# Altium schematic sheet [08] - CPU - SPI, I2C, SD, MMC.SchDoc
size A2; DocumentNumber: 8; SheetNumber: 8; SheetTotal: 20
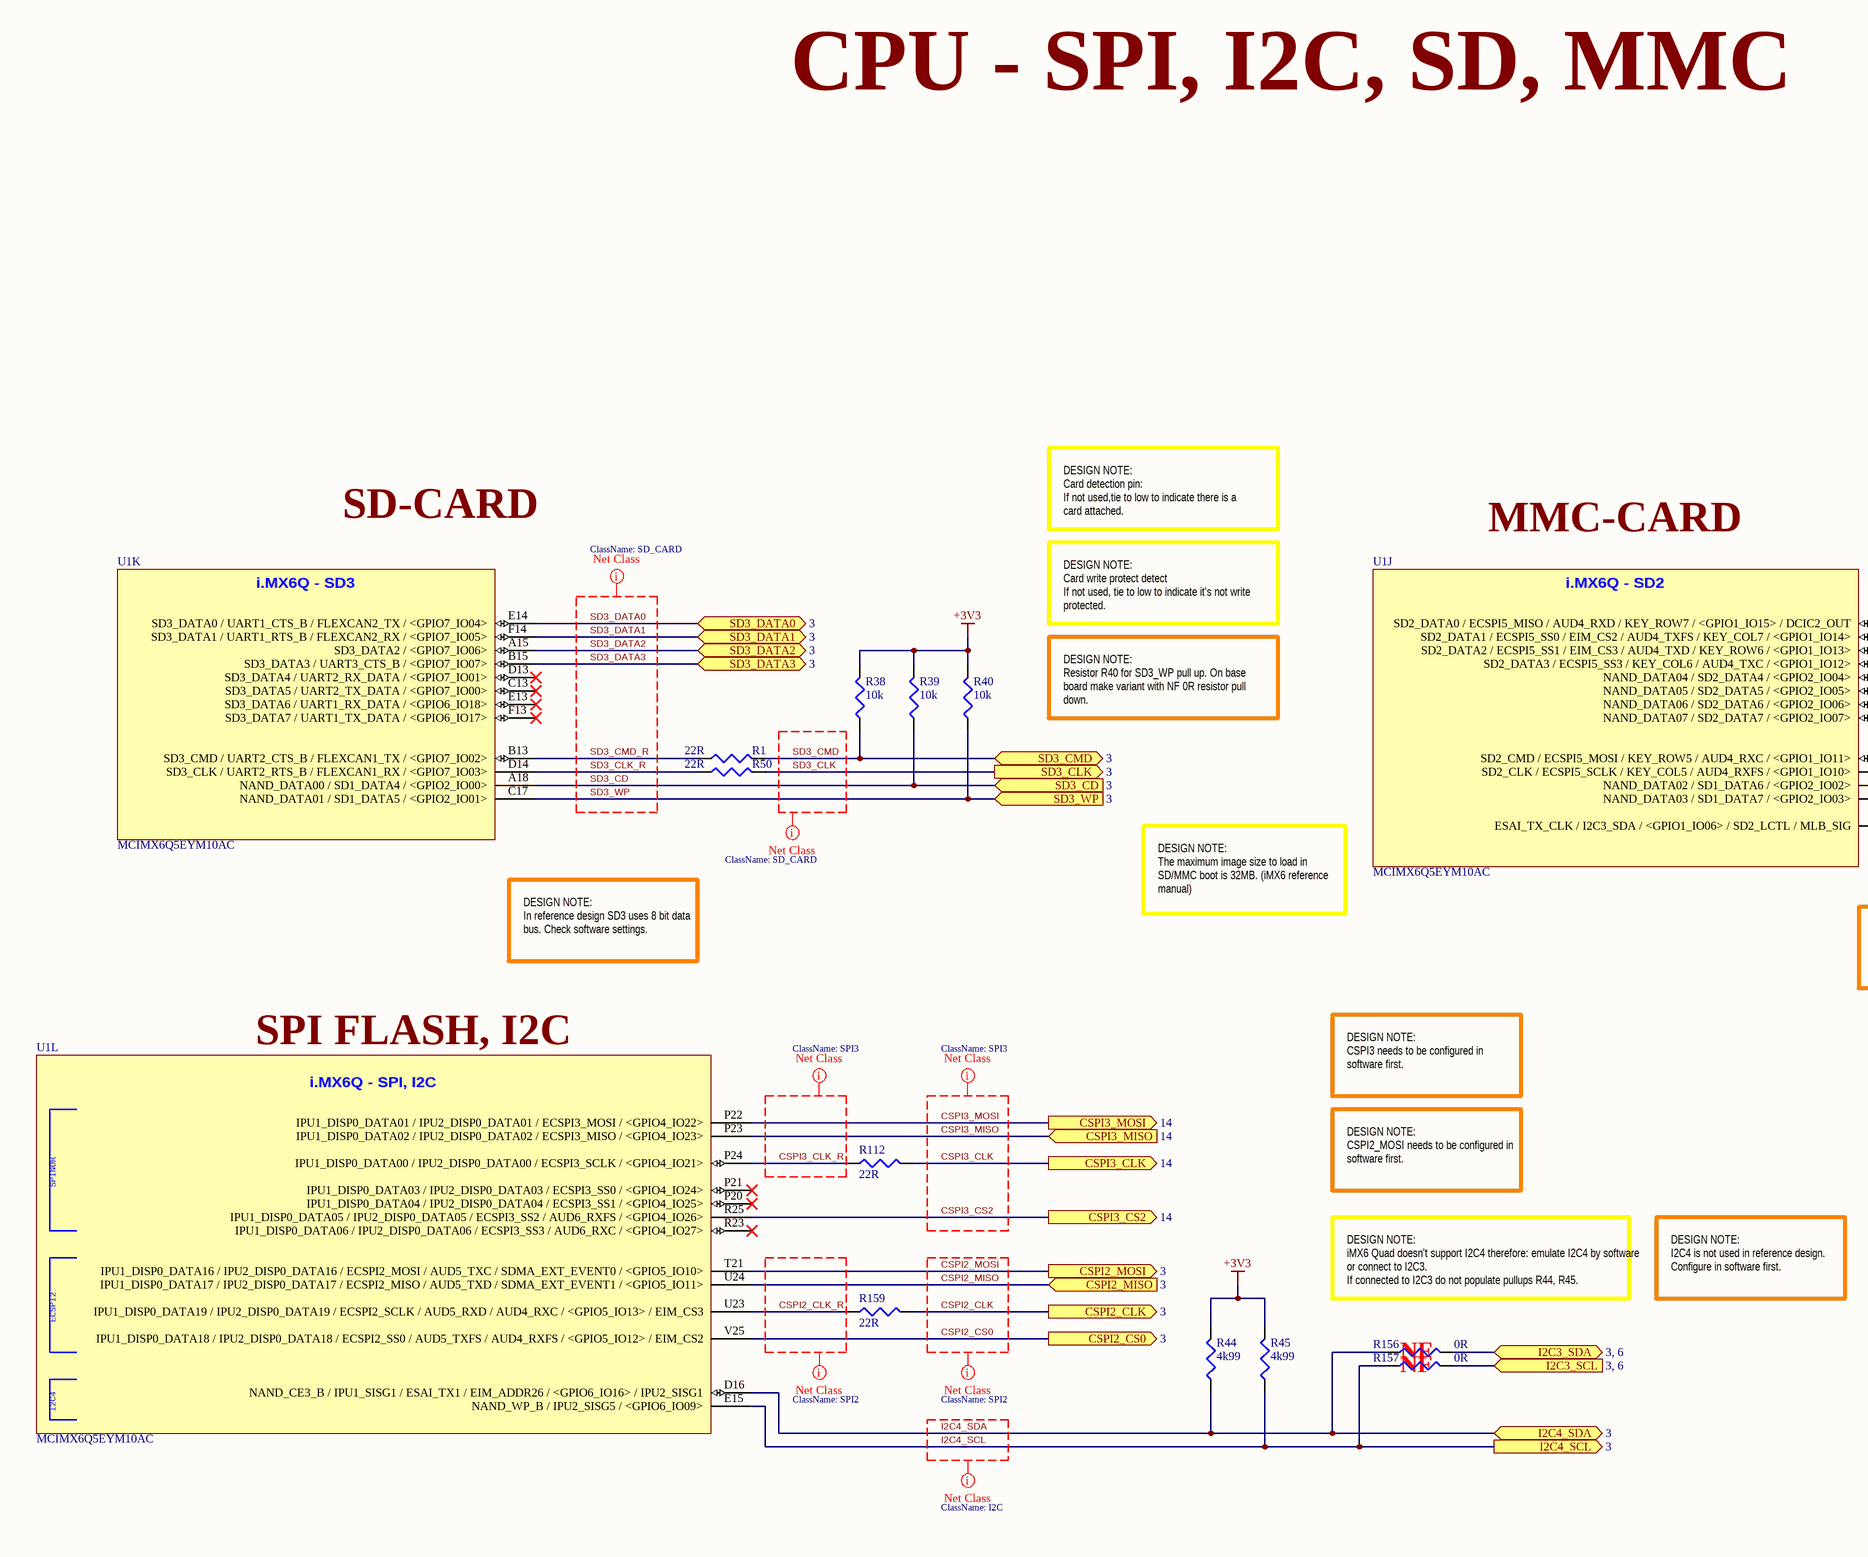
[diagram p0: [08] - CPU - SPI, I2C, SD, MMC.SchDoc, left]
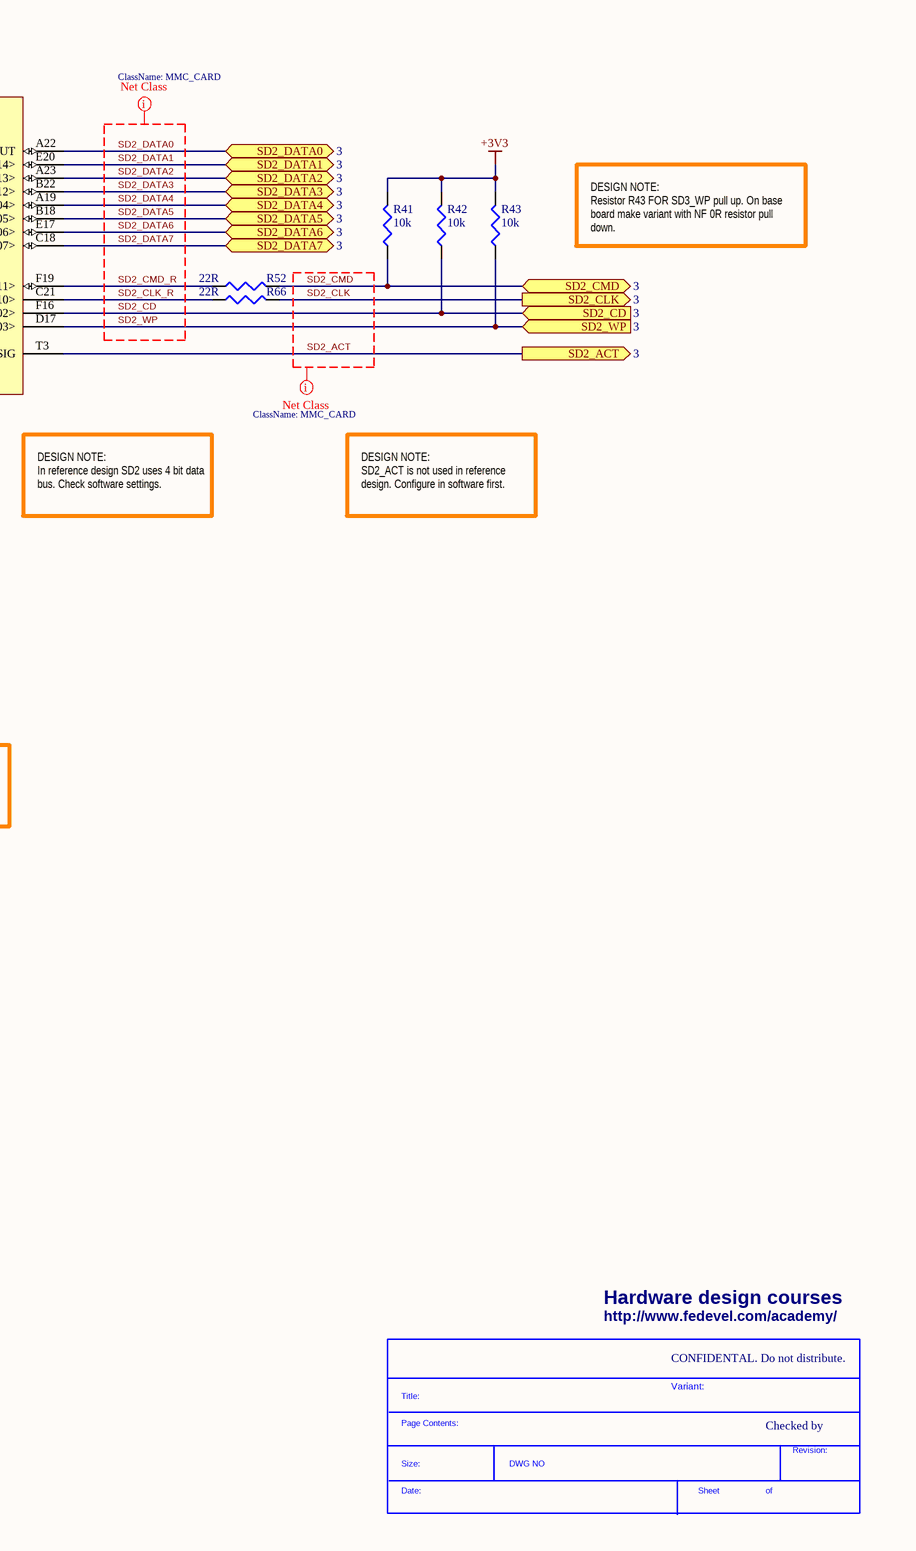
[diagram p1: [08] - CPU - SPI, I2C, SD, MMC.SchDoc, right]

## Parts
*  SDTitleBlock  (value not drawn)  (graphical)
R1  22R  [R0402]
R38  10k  [R0402]
R39  10k  [R0402]
R40  10k  [R0402]
R41  10k  [R0402]
R42  10k  [R0402]
R43  10k  [R0402]
R44  4k99  [R0402]
R45  4k99  [R0402]
R50  22R  [R0402]
R52  22R  [R0402]
R66  22R  [R0402]
R112  22R  [R0402]
R156  0R  [R0402]
R157  0R  [R0402]
R159  22R  [R0402]
U1  MCIMX6Q5EYM10AC  [PBGA624]  (parts J,K,L of 15)

## Ports
CSPI2_CLK (out, see 3), CSPI2_CS0 (out, see 3), CSPI2_MISO (in, see 3), CSPI2_MOSI (out, see 3), CSPI3_CLK (out, see 14), CSPI3_CS2 (out, see 14), CSPI3_MISO (in, see 14), CSPI3_MOSI (out, see 14), I2C3_SCL (see 3, 6), I2C3_SDA (bidir, see 3, 6), I2C4_SCL (out, see 3), I2C4_SDA (bidir, see 3), SD2_ACT (out, see 3), SD2_CD (in, see 3), SD2_CLK (out, see 3), SD2_CMD (bidir, see 3), SD2_DATA0 (bidir, see 3), SD2_DATA1 (bidir, see 3), SD2_DATA2 (bidir, see 3), SD2_DATA3 (bidir, see 3), SD2_DATA4 (bidir, see 3), SD2_DATA5 (bidir, see 3), SD2_DATA6 (bidir, see 3), SD2_DATA7 (bidir, see 3), SD2_WP (in, see 3), SD3_CD (in, see 3), SD3_CLK (out, see 3), SD3_CMD (bidir, see 3), SD3_DATA0 (bidir, see 3), SD3_DATA1 (bidir, see 3), SD3_DATA2 (bidir, see 3), SD3_DATA3 (bidir, see 3), SD3_WP (in, see 3)

## Nets
+3V3: R38.2 R39.2 R40.2 R41.2 R42.2 R43.2 R44.2 R45.2
CSPI2_CLK: R159.2 ; port CSPI2_CLK
CSPI2_CLK_R: R159.1 U1.U23(IPU1_DISP0_DATA19_/_IPU2_DISP0_DATA19_/_ECSPI2_SCLK_/_AUD5_RXD_/_AUD4_RXC_/_<GPIO5_IO13>_/_EIM_CS3)
CSPI2_CS0: U1.V25(IPU1_DISP0_DATA18_/_IPU2_DISP0_DATA18_/_ECSPI2_SS0_/_AUD5_TXFS_/_AUD4_RXFS_/_<GPIO5_IO12>_/_EIM_CS2) ; port CSPI2_CS0
CSPI2_MISO: U1.U24(IPU1_DISP0_DATA17_/_IPU2_DISP0_DATA17_/_ECSPI2_MISO_/_AUD5_TXD_/_SDMA_EXT_EVENT1_/_<GPIO5_IO11>) ; port CSPI2_MISO
CSPI2_MOSI: U1.T21(IPU1_DISP0_DATA16_/_IPU2_DISP0_DATA16_/_ECSPI2_MOSI_/_AUD5_TXC_/_SDMA_EXT_EVENT0_/_<GPIO5_IO10>) ; port CSPI2_MOSI
CSPI3_CLK: R112.2 ; port CSPI3_CLK
CSPI3_CLK_R: R112.1 U1.P24(IPU1_DISP0_DATA00_/_IPU2_DISP0_DATA00_/_ECSPI3_SCLK_/_<GPIO4_IO21>)
CSPI3_CS2: U1.R25(IPU1_DISP0_DATA05_/_IPU2_DISP0_DATA05_/_ECSPI3_SS2_/_AUD6_RXFS_/_<GPIO4_IO26>) ; port CSPI3_CS2
CSPI3_MISO: U1.P23(IPU1_DISP0_DATA02_/_IPU2_DISP0_DATA02_/_ECSPI3_MISO_/_<GPIO4_IO23>) ; port CSPI3_MISO
CSPI3_MOSI: U1.P22(IPU1_DISP0_DATA01_/_IPU2_DISP0_DATA01_/_ECSPI3_MOSI_/_<GPIO4_IO22>) ; port CSPI3_MOSI
I2C3_SCL: R157.2 ; port I2C3_SCL
I2C3_SDA: R156.2 ; port I2C3_SDA
I2C4_SCL: R45.1 R157.1 U1.E15(NAND_WP_B_/_IPU2_SISG5_/_<GPIO6_IO09>) ; port I2C4_SCL
I2C4_SDA: R44.1 R156.1 U1.D16(NAND_CE3_B_/_IPU1_SISG1_/_ESAI_TX1_/_EIM_ADDR26_/_<GPIO6_IO16>_/_IPU2_SISG1) ; port I2C4_SDA
SD2_ACT: U1.T3(ESAI_TX_CLK_/_I2C3_SDA_/_<GPIO1_IO06>_/_SD2_LCTL_/_MLB_SIG) ; port SD2_ACT
SD2_CD: R42.1 U1.F16(NAND_DATA02_/_SD1_DATA6_/_<GPIO2_IO02>) ; port SD2_CD
SD2_CLK: R66.2 ; port SD2_CLK
SD2_CLK_R: R66.1 U1.C21(SD2_CLK_/_ECSPI5_SCLK_/_KEY_COL5_/_AUD4_RXFS_/_<GPIO1_IO10>)
SD2_CMD: R41.1 R52.2 ; port SD2_CMD
SD2_CMD_R: R52.1 U1.F19(SD2_CMD_/_ECSPI5_MOSI_/_KEY_ROW5_/_AUD4_RXC_/_<GPIO1_IO11>)
SD2_DATA0: U1.A22(SD2_DATA0_/_ECSPI5_MISO_/_AUD4_RXD_/_KEY_ROW7_/_<GPIO1_IO15>_/_DCIC2_OUT) ; port SD2_DATA0
SD2_DATA1: U1.E20(SD2_DATA1_/_ECSPI5_SS0_/_EIM_CS2_/_AUD4_TXFS_/_KEY_COL7_/_<GPIO1_IO14>) ; port SD2_DATA1
SD2_DATA2: U1.A23(SD2_DATA2_/_ECSPI5_SS1_/_EIM_CS3_/_AUD4_TXD_/_KEY_ROW6_/_<GPIO1_IO13>) ; port SD2_DATA2
SD2_DATA3: U1.B22(SD2_DATA3_/_ECSPI5_SS3_/_KEY_COL6_/_AUD4_TXC_/_<GPIO1_IO12>) ; port SD2_DATA3
SD2_DATA4: U1.A19(NAND_DATA04_/_SD2_DATA4_/_<GPIO2_IO04>) ; port SD2_DATA4
SD2_DATA5: U1.B18(NAND_DATA05_/_SD2_DATA5_/_<GPIO2_IO05>) ; port SD2_DATA5
SD2_DATA6: U1.E17(NAND_DATA06_/_SD2_DATA6_/_<GPIO2_IO06>) ; port SD2_DATA6
SD2_DATA7: U1.C18(NAND_DATA07_/_SD2_DATA7_/_<GPIO2_IO07>) ; port SD2_DATA7
SD2_WP: R43.1 U1.D17(NAND_DATA03_/_SD1_DATA7_/_<GPIO2_IO03>) ; port SD2_WP
SD3_CD: R39.1 U1.A18(NAND_DATA00_/_SD1_DATA4_/_<GPIO2_IO00>) ; port SD3_CD
SD3_CLK: R50.2 ; port SD3_CLK
SD3_CLK_R: R50.1 U1.D14(SD3_CLK_/_UART2_RTS_B_/_FLEXCAN1_RX_/_<GPIO7_IO03>)
SD3_CMD: R1.2 R38.1 ; port SD3_CMD
SD3_CMD_R: R1.1 U1.B13(SD3_CMD_/_UART2_CTS_B_/_FLEXCAN1_TX_/_<GPIO7_IO02>)
SD3_DATA0: U1.E14(SD3_DATA0_/_UART1_CTS_B_/_FLEXCAN2_TX_/_<GPIO7_IO04>) ; port SD3_DATA0
SD3_DATA1: U1.F14(SD3_DATA1_/_UART1_RTS_B_/_FLEXCAN2_RX_/_<GPIO7_IO05>) ; port SD3_DATA1
SD3_DATA2: U1.A15(SD3_DATA2_/_<GPIO7_IO06>) ; port SD3_DATA2
SD3_DATA3: U1.B15(SD3_DATA3_/_UART3_CTS_B_/_<GPIO7_IO07>) ; port SD3_DATA3
SD3_WP: R40.1 U1.C17(NAND_DATA01_/_SD1_DATA5_/_<GPIO2_IO01>) ; port SD3_WP

Not connected (* = marked no-connect by the designer): U1 C13(SD3_DATA5_/_UART2_TX_DATA_/_<GPIO7_IO00>)* D13(SD3_DATA4_/_UART2_RX_DATA_/_<GPIO7_IO01>)* E13(SD3_DATA6_/_UART1_RX_DATA_/_<GPIO6_IO18>)* F13(SD3_DATA7_/_UART1_TX_DATA_/_<GPIO6_IO17>)* P20(IPU1_DISP0_DATA04_/_IPU2_DISP0_DATA04_/_ECSPI3_SS1_/_<GPIO4_IO25>)* P21(IPU1_DISP0_DATA03_/_IPU2_DISP0_DATA03_/_ECSPI3_SS0_/_<GPIO4_IO24>)* R23(IPU1_DISP0_DATA06_/_IPU2_DISP0_DATA06_/_ECSPI3_SS3_/_AUD6_RXC_/_<GPIO4_IO27>)*

## Layout directives
net class SPI3: CSPI3_CLK, CSPI3_CLK_R, CSPI3_CS2, CSPI3_MISO, CSPI3_MOSI
net class SPI2: CSPI2_CLK, CSPI2_CLK_R, CSPI2_CS0, CSPI2_MISO, CSPI2_MOSI
net class I2C: I2C4_SCL, I2C4_SDA
net class SD_CARD: SD3_CD, SD3_CLK, SD3_CLK_R, SD3_CMD, SD3_CMD_R, SD3_DATA0, SD3_DATA1, SD3_DATA2, SD3_DATA3, SD3_WP
net class MMC_CARD: SD2_ACT, SD2_CD, SD2_CLK, SD2_CLK_R, SD2_CMD, SD2_CMD_R, SD2_DATA0, SD2_DATA1, SD2_DATA2, SD2_DATA3, SD2_DATA4, SD2_DATA5, SD2_DATA6, SD2_DATA7, SD2_WP

## Notes on the sheet
- CPU - SPI, I2C, SD, MMC
- SD-CARD
- DESIGN NOTE:
  Card detection pin:
  If not used,tie to low to indicate there is a card attached.
- MMC-CARD
- DESIGN NOTE:
  Card write protect detect
  If not used, tie to low to indicate it's not write protected.
- DESIGN NOTE:
  Resistor R40 for SD3_WP pull up. On base board make variant with NF 0R resistor pull down.
- DESIGN NOTE:
  Resistor R43 FOR SD3_WP pull up. On base board make variant with NF 0R resistor pull down.
- DESIGN NOTE:
  The maximum image size to load in SD/MMC boot is 32MB. (iMX6 reference manual)
- DESIGN NOTE:
  In reference design SD3 uses 8 bit data bus. Check software settings.
- DESIGN NOTE:
  In reference design SD2 uses 4 bit data bus. Check software settings.
- DESIGN NOTE:
  SD2_ACT is not used in reference design. Configure in software first.
- SPI FLASH, I2C
- DESIGN NOTE:
  CSPI3 needs to be configured in software first.
- DESIGN NOTE:
  CSPI2_MOSI needs to be configured in software first.
- DESIGN NOTE:
  iMX6 Quad doesn't support I2C4 therefore: emulate I2C4 by software or connect to I2C3.
  If connected to I2C3 do not populate pullups R44, R45.
- DESIGN NOTE:
  I2C4 is not used in reference design. Configure in software first.
- NF
- Hardware design courses
- http://www.fedevel.com/academy/
- CONFIDENTAL. Do not distribute.
- Variant:
- Checked by
- (in symbol MCIMX6Q5EYM10AC, part J) i.MX6Q - SD2
- (in symbol MCIMX6Q5EYM10AC, part K) i.MX6Q - SD3
- (in symbol MCIMX6Q5EYM10AC, part L) i.MX6Q - SPI, I2C; SPINOR; ECSPI2; I2C4
- (in symbol SDTitleBlock) Title:; Page Contents:; Revision:; Size:; DWG NO; Date:; Sheet; of

## Library data of the parts
R1 R50 R52 R66 R112 R159 = RC0402FR-0722RL: RES 22.0 OHM 1/16W 1% 0402 SMD; Manufacturer: Yageo; Resistance (Ohms): 22; Power (Watts): 0.063W, 1/16W; .Checked PCB: used; Temperature Coefficient: ±100ppm/°C; Category: Resistors; Supplier Part Number: 311-22.0LRCT-ND; Manufacturer Part Number: RC0402FR-0722RL; Package / Case: 0402 (1005 Metric); Price 1k [$]: 0.01421; Tolerance: ±1%; Value: 22R; .Checked SCH: used; Supplier: Digikey; Supplier 1: Digi-Key; Supplier Part Number 1: 311-22.0LRCT-ND; RoHS: RoHS Compliant; Stock 1: 943800; Pricing 1: 10=0.014, 50=0.0104, 100=0.0079, 250=0.00584, 500=0.00432, 1000=0.00288 (USD); Composition: Thick Film; Features: -; Size / Dimension: 0.039" L x 0.020" W (1.00mm x 0.50mm); Height: 0.016" (0.40mm); Number of Terminations: 2; Packaging: Cut Tape (CT); ComponentLink1URL: http://www.yageo.com/documents/recent/PYu-RC0402_51_RoHS_L_6.pdf; ComponentLink1Description: http://www.yageo.com/documents/recent/PYu-RC0402_51_RoHS_L_6.pdf
R38-R43 = RC0402FR-0710KL: RES 10.0K OHM 1/16W 1% 0402 SMD; Manufacturer: Yageo; Power (Watts): 0.063W, 1/16W; .Checked PCB: used; Temperature Coefficient: ±100ppm/°C; Category: Resistors; Supplier Part Number: 311-10.0KLRCT-ND; Manufacturer Part Number: RC0402FR-0710KL; Package / Case: 0402 (1005 Metric); Price 1k [$]: 0.01421; Resistance (Ohms): 10K; Tolerance: ±1%; Value: 10k; .Checked SCH: used; Supplier: Digikey; Supplier 1: Digi-Key; Supplier Part Number 1: 311-10.0KLRCT-ND; RoHS: RoHS Compliant; Stock 1: 2916495; Pricing 1: 10=0.014, 50=0.0104, 100=0.0079, 250=0.00584, 500=0.00432, 1000=0.00288 (USD); Composition: Thick Film; Features: -; Size / Dimension: 0.039" L x 0.020" W (1.00mm x 0.50mm); Height: 0.016" (0.40mm); Number of Terminations: 2; Packaging: Cut Tape (CT); ComponentLink1URL: http://www.yageo.com/documents/recent/PYu-RC0402_51_RoHS_L_6.pdf; ComponentLink1Description: http://www.yageo.com/documents/recent/PYu-RC0402_51_RoHS_L_6.pdf
R44 R45 = RMCF0402FT4K99: RES TF 4.99K OHM 1% 1/16W 0402; Manufacturer: Stackpole Electronics Inc; Power (Watts): 0.063W, 1/16W; .Checked PCB: used; Temperature Coefficient: ±100ppm/°C; Category: Resistors; Supplier Part Number: RMCF0402FT4K99CT-ND; Manufacturer Part Number: RMCF0402FT4K99; Package / Case: 0402 (1005 Metric); Price 1k [$]: 0.00384; Resistance (Ohms): 4.99K; Tolerance: ±1%; Value: 4k99; .Checked SCH: used; Supplier: Digikey; Supplier 1: Digi-Key; Supplier Part Number 1: RMCF0402FT4K99CT-ND; RoHS: RoHS Compliant; Stock 1: 48509; Pricing 1: 1=0.04, 10=0.025, 50=0.0138, 100=0.0105, 250=0.0078, 500=0.00576, 1000=0.00384 (USD); Composition: Thick Film; Features: -; Size / Dimension: 0.039" L x 0.020" W (1.00mm x 0.50mm); Height: 0.016" (0.40mm); Number of Terminations: 2; Packaging: Cut Tape (CT); ComponentLink1URL: http://www.seielect.com/Catalog/SEI-RMCF.pdf; ComponentLink1Description: http://www.seielect.com/Catalog/SEI-RMCF.pdf
R156 R157 = RC0402JR-070RL: RES 0.0 OHM 1/16W 0402 SMD; Manufacturer: Yageo; Resistance (Ohms): 0.0; Power (Watts): 0.063W, 1/16W; Tolerance: Jumper; .Checked PCB: used; Category: Resistors; Supplier Part Number: 311-0.0JRCT-ND; Manufacturer Part Number: RC0402JR-070RL; Package / Case: 0402 (1005 Metric); Price 1k [$]: 0.01389; Value: 0R; .Checked SCH: used; Supplier: Digikey; Supplier 1: Digi-Key; Supplier Part Number 1: 311-0.0JRCT-ND; RoHS: RoHS Compliant; Stock 1: 1106330; Pricing 1: 10=0.012, 50=0.009, 100=0.0069, 250=0.00512, 500=0.0038, 1000=0.00253 (USD); Composition: Thick Film; Features: -; Temperature Coefficient: -; Size / Dimension: 0.039" L x 0.020" W (1.00mm x 0.50mm); Height: 0.016" (0.40mm); Number of Terminations: 2; Packaging: Cut Tape (CT); ComponentLink1URL: http://www.yageo.com/documents/recent/PYu-RC0402_51_RoHS_L_6.pdf; ComponentLink1Description: http://www.yageo.com/documents/recent/PYu-RC0402_51_RoHS_L_6.pdf
U1 = MCIMX6Q5EYM10AC: IC MCU 32BIT ARM QUAD 624FCBGA; Manufacturer: Freescale Semiconductor; Core Processor: ARM® Cortex™-A9; Core Size: 32-Bit Quad-Core; Speed: 1.0GHz; Connectivity: CAN, EBI/EMI, ESAI, Ethernet, GPMI, I2C, MMC/SD, PCI, SATA, SPI, UART, USB, USB OTG; Peripherals: DMA, HDMI, I2S/SSI/AC97, MIPI CSI, MIMI DSI, MIPI HIS, PWM, WDT; Number of I /O: 224; Program Memory Type: External Program Memory; RAM Size: 256K x 8; Voltage - Supply (Vcc/Vdd): 0.925 V ~ 1.5 V; Oscillator Type: Internal; .Creator: MM; .Checked PCB: MM, checked by RF; Supplier 1: Digi-Key; Manufacturer Part Number: MCIMX6Q5EYM10AC; RoHS: RoHS Compliant; Category: Integrated Circuits (ICs); Stock 1: 0; Pricing 1: 1=54.98, 10=51.922, 25=48.868, 100=30.5424 (USD); Program Memory Size: -; EEPROM Size: -; Data Converters: -; Operating Temperature: -20°C ~ 105°C; Package / Case: 624-FBGA, FCBGA; Packaging: Tray; ComponentLink1URL: http://cache.freescale.com/files/32bit/doc/data_sheet/IMX6DQCEC.pdf; ComponentLink1Description: http://cache.freescale.com/files/32bit/doc/data_sheet/IMX6DQCEC.pdf; Supplier Part Number 1: MCIMX6Q5EYM10AC-ND; .Checked SCH: MM